# Altium schematic sheet TCAN330_PINOUT.SchDoc
size A4; SheetNumber: 8; SheetTotal: 9
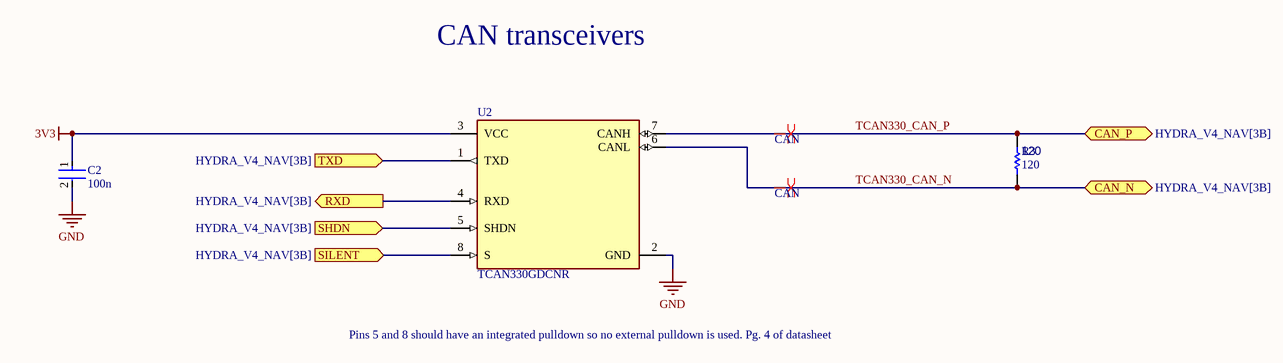
[diagram p0: TCAN330_PINOUT.SchDoc]

## Parts
C2  100n  [FP-0402-L_1_0_0_05-W_0_5-IPC_A]
R3  120  [R0603B]
U2  TCAN330GDCNR  [FP-DCN0008A-MFG]

## Ports
CAN_N (bidir, see HYDRA_V4_NAV[3B]), CAN_P (bidir, see HYDRA_V4_NAV[3B]), RXD (out, see HYDRA_V4_NAV[3B]), SHDN (in, see HYDRA_V4_NAV[3B]), SILENT (in, see HYDRA_V4_NAV[3B]), TXD (in, see HYDRA_V4_NAV[3B])

## Nets
3V3: C2.1 U2.3(VCC)
GND: C2.2 U2.2(GND)
RXD: U2.4(RXD) ; port RXD
SHDN: U2.5(SHDN) ; port SHDN
SILENT: U2.8(S) ; port SILENT
TCAN330_CAN_N: R3.1 U2.6(CANL) ; port CAN_N
TCAN330_CAN_P: R3.2 U2.7(CANH) ; port CAN_P
TXD: U2.1(TXD) ; port TXD

## Layout directives
differential pair; net class CAN: TCAN330_CAN_N, TCAN330_CAN_P

## Notes on the sheet
- CAN transceivers
- Pins 5 and 8 should have an integrated pulldown so no external pulldown is used. Pg. 4 of datasheet

## Library data of the parts
C2 = CMP-001-00058-1: LARGE PADS, 0402 CAP, CHANGE COMMENT TO MATCH REAL P/N; Capacitor Type: Ceramic; Value: 100n; Min Operating Temperature: -55°C; Mounting Technology: Surface Mount; Pins: 2; Case/Package: 0402; RoHS Compliant: Yes; Max Operating Temperature: 85°C
R3 = CMP-009-00002-14: Resistor; Value: 120
U2 = CMP-04872-000178-1: IC TRANSCEIVER 1/1 SOT23-8; Data Rate: 1Mbps; Packaging: Tape and Reel; Min Operating Temperature: -40°C; Max Operating Temperature: 125°C; RoHS Compliant: Yes; Lead Free: Lead Free; Case/Package: SOT-23-8; Mount: Surface Mount